# Altium schematic sheet Sheet2.SchDoc
size A
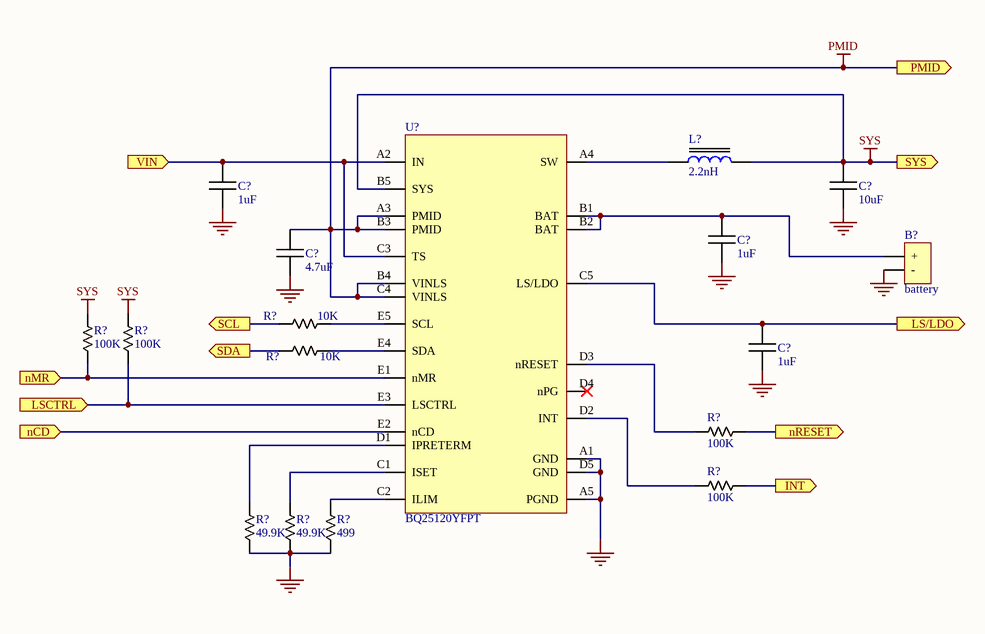
[diagram p0: Sheet2.SchDoc]

## Parts
(Parts that share a designator on the sheet are numbered #1, #2 ... from top to bottom, then left to right.)
B?  battery
C?#1  1uF
C?#2  10uF
C?#3  1uF
C?#4  4.7uF  [C0603]
C?#5  1uF
L?  2.2nH
R?#1  10K  [R0603]
R?#2  100K  [R0603]
R?#3  100K  [R0603]
R?#4  10K  [R0603]
R?#5  100K  [R0603]
R?#6  100K  [R0603]
R?#7  49.9K
R?#8  49.9K
R?#9  499
U?  BQ25120YFPT

## Ports
INT (out), LS/LDO (out), LSCTRL (in), nCD (in), nMR (in), nRESET (out), PMID (out), SCL (out), SDA (out), SYS (out), VIN (in)

## Nets
GND: B?.- C?#1.1 C?#2.1 C?#3.1 C?#4.1 C?#5.1 R?#7.1 R?#8.1 R?#9.1 U?.A1(GND) U?.A5(PGND) U?.D5(GND)
PMID: C?#4.2 U?.A3(PMID) U?.B3(PMID) U?.B4(VINLS) U?.C4(VINLS) ; port PMID
SYS: C?#2.2 L?.2 R?#2.2 R?#3.2 U?.B5(SYS) ; port SYS
INT: R?#6.1 ; port INT
LS/LDO: C?#5.2 U?.C5(LS/LDO) ; port LS/LDO
LSCTRL: R?#3.1 U?.E3(LSCTRL) ; port LSCTRL
nCD: U?.E2(nCD) ; port nCD
nMR: R?#2.1 U?.E1(nMR) ; port nMR
nRESET: R?#5.1 ; port nRESET
SCL: R?#1.1 ; port SCL
SDA: R?#4.1 ; port SDA
VIN: C?#1.2 U?.A2(IN) U?.C3(TS) ; port VIN
NetB?_+: B?.+ C?#3.2 U?.B1(BAT) U?.B2(BAT)
NetL?_1: L?.1 U?.A4(SW)
NetR?#1_2: R?#1.2 U?.E5(SCL)
NetR?#4_2: R?#4.2 U?.E4(SDA)
NetR?#5_2: R?#5.2 U?.D3(nRESET)
NetR?#6_2: R?#6.2 U?.D2(INT)
NetR?#7_2: R?#7.2 U?.D1(IPRETERM)
NetR?#8_2: R?#8.2 U?.C1(ISET)
NetR?#9_2: R?#9.2 U?.C2(ILIM)

Not connected (* = marked no-connect by the designer): U? D4(nPG)*

## Library data of the parts
B? = Battery: 100MAH; website: https://www.adafruit.com/product/1570
C?#1 C?#3 C?#5 = C1uF_0402: SMD_CAPACITOR; Voltage - Rated: 10V; Tolerance: ±10%; Packet: 0402; Digi-Key Part Number: 490-3890-1-ND; Capacitance: 1uF
C?#2 = C10uF_0603: SMD_CAPACITOR; Voltage - Rated: 6.3V; Tolerance: ±20%; Packet: 0603; Digi-Key Part Number: 490-3896-1-ND; Capacitance: 10uF
C?#4 = C4.7u_0603: SMD_CAPACITOR; Voltage - Rated: 16V; Tolerance: ±10%; Packet: 0603; Digi-Key Part Number: 311-1785-1-ND; Capacitance: 4.7uF
L? = L2.2nH_0201: SMD_Inductor; Digi-Key Part Number: LQP03TG2N2C02D; Inductance: 2.2nH; Package: 0201
R?#1 R?#4 = R10K_0201: SMD_RESISTOR; Packet: 0201; Tolerance: ±5%; Power: 1/20W; Digi-Key Part Number: 311-10KNCT-ND; Value: 10K
R?#2 R?#3 R?#5 R?#6 = R100K_0402: SMD_RESISTOR; Packet: 0402; Tolerance: ±5%; Power: 1/16W; Digi-Key Part Number: 541-2190-1-ND; Value: 100K
R?#7 R?#8 = R49.9K_0402: SMD_RESISTOR; Packet: 0402; Tolerance: ±1%; Power: 1/16W; Digi-Key Part Number: 311-49.9KLRCT-ND; Value: 49.9K
R?#9 = R499_0402: SMD_RESISTOR; Packet: 0402; Tolerance: ±1%; Power: 1/16W; Digi-Key Part Number: 311-499LRCT-ND; Value: 499
U? = BQ25120YFF: Digi-Key Part Number: 296-42554-1-ND